# EAGLE schematic TM (EAGLE 7.5.0)
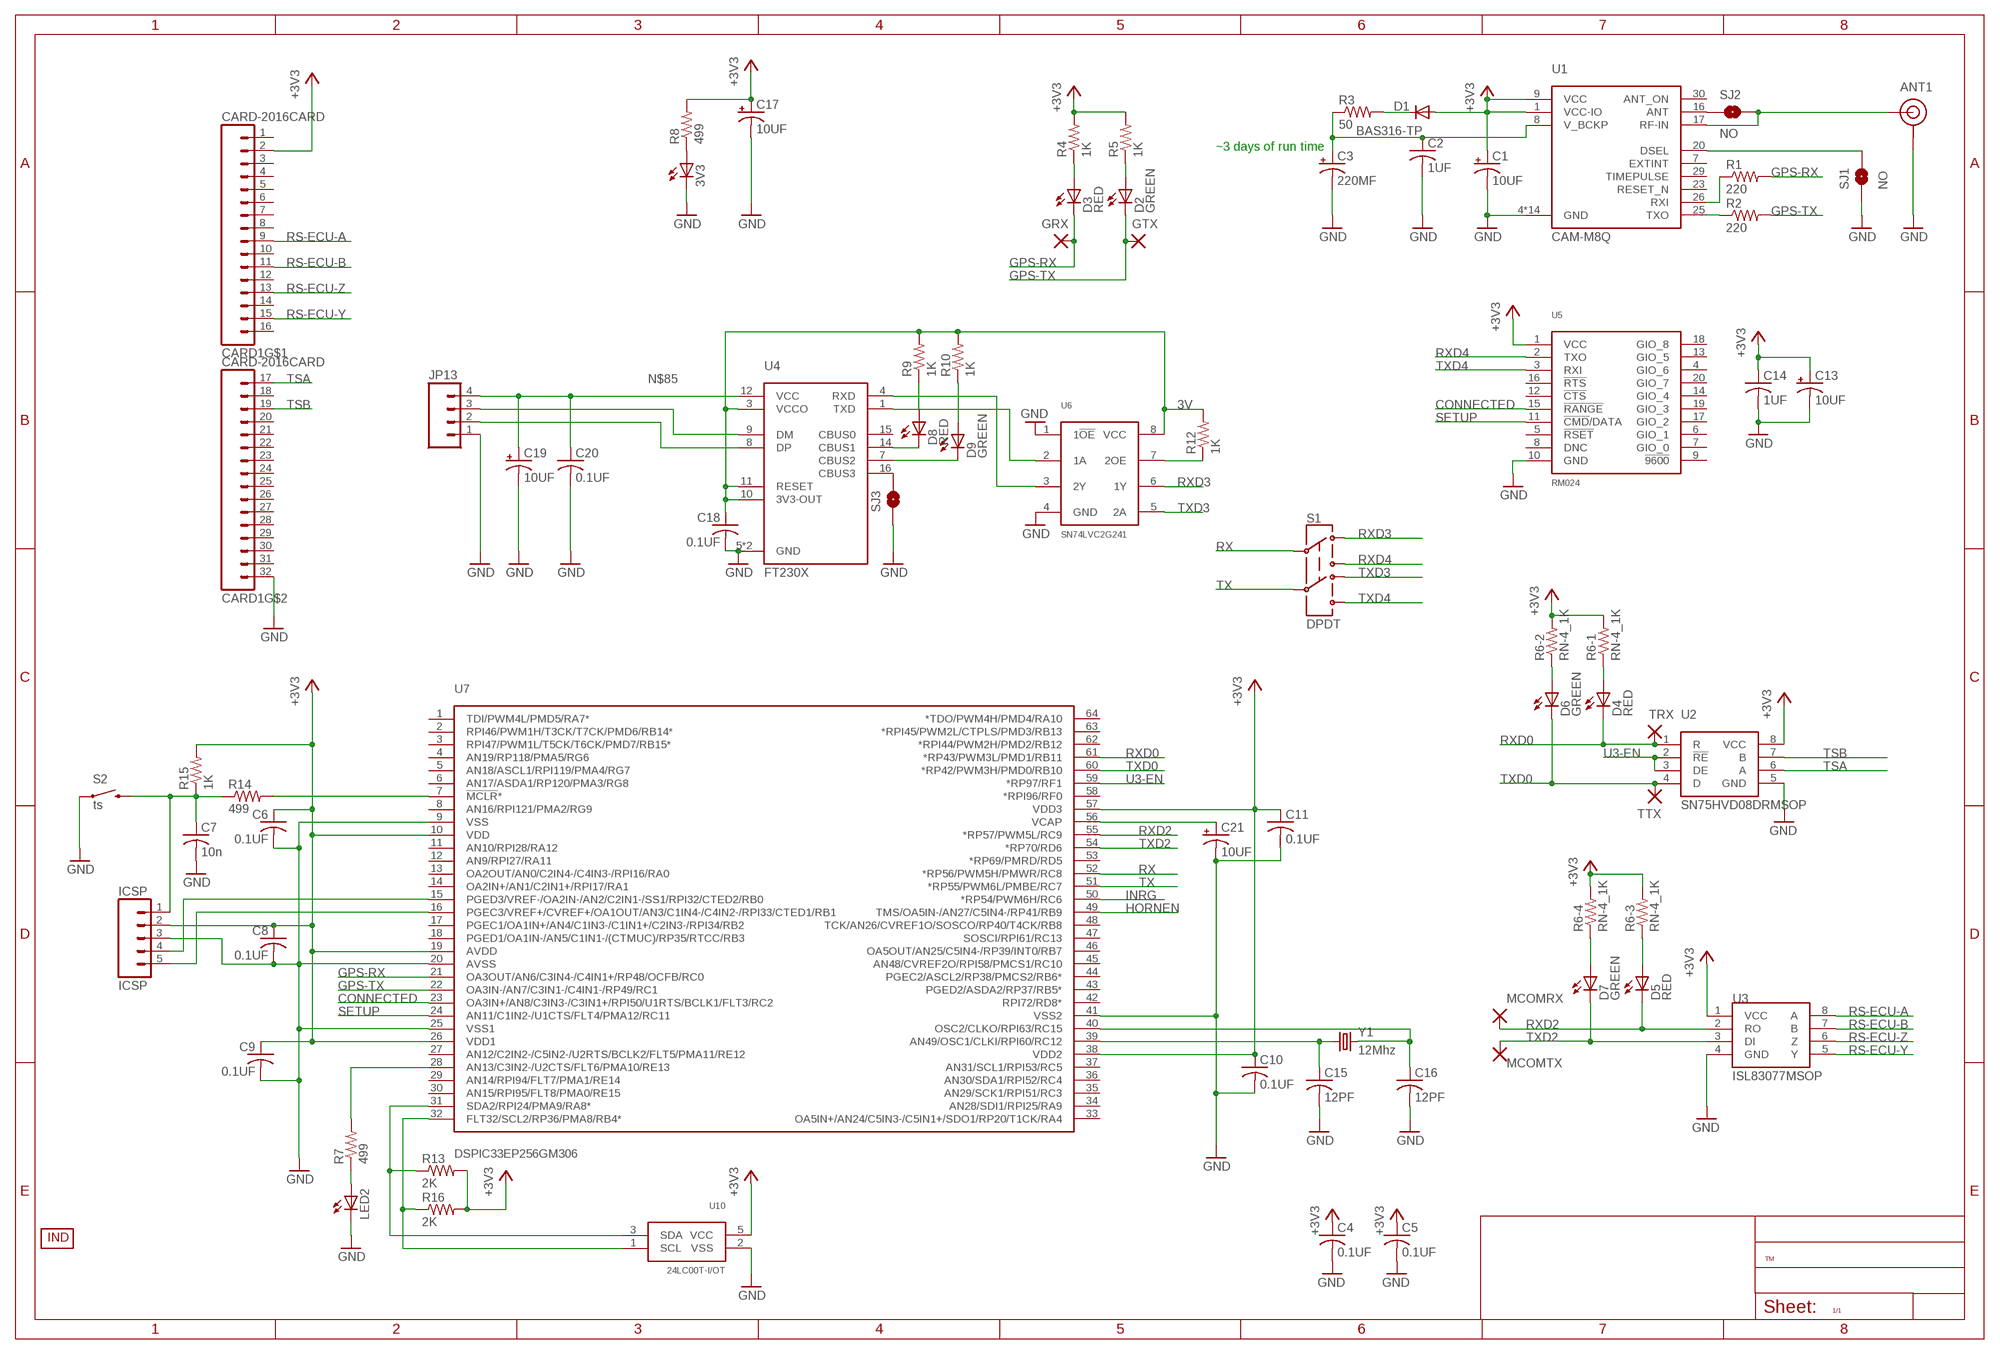
[diagram p0: schematic, sheet 1]

## Parts
3V3  LEDCHIP-LED0805  [CHIP-LED0805]
ANT1  CONMCX002  SMA  [CONSMA002]
C1  10UF  CAP-POL_10UF_16V  [EIA3216-16V]
C2  1UF  CAP_1UF_50V_0805  [0805]
C3  220MF  CAP-POL_220MF_5.5V  [EEC-S0HD224V]
C4  0.1UF  CAP_0.1UF_50V_0805  [0805]
C5  0.1UF  CAP_0.1UF_50V_0805  [0805]
C6  0.1UF  CAP_0.1UF_50V_0805  [0805]
C7  10n  C-USC0805  [C0805]
C8  0.1UF  CAP_0.1UF_50V_0805  [0805]
C9  0.1UF  CAP_0.1UF_50V_0805  [0805]
C10  0.1UF  CAP_0.1UF_50V_0805  [0805]
C11  0.1UF  CAP_0.1UF_50V_0805  [0805]
C13  10UF  CAP-POL_10UF_16V  [EIA3216-16V]
C14  1UF  CAP_1UF_50V_0805  [0805]
C15  12PF  CAP_12PF_50V_0805  [0805]
C16  12PF  CAP_12PF_50V_0805  [0805]
C17  10UF  CAP-POL_10UF_16V  [EIA3216-16V]
C18  0.1UF  CAP_0.1UF_50V_0805  [0805]
C19  10UF  CAP-POL_10UF_16V  [EIA3216-16V]
C20  0.1UF  CAP_0.1UF_50V_0805  [0805]
C21  10UF  CAP-POL_10UF_16V  [EIA3216-16V]
CARD1  CARD-2016CARD  [CARD-2016]
D1  BAS316-TP  DIODESOD  [SOD-323]
D2  GREEN  LED_GREEN  [CHIP_LED0805]
D3  RED  LED_RED  [CHIP_LED0805]
D4  RED  LED_RED  [CHIP_LED0805]
D5  RED  LED_RED  [CHIP_LED0805]
D6  GREEN  LED_GREEN  [CHIP_LED0805]
D7  GREEN  LED_GREEN  [CHIP_LED0805]
D8  RED  LED_RED  [CHIP_LED0805]
D9  GREEN  LED_GREEN  [CHIP_LED0805]
GRX  TP  [0603]
GTX  TP  [0603]
ICSP  ICSP  M05LOCK_LONGPADS  [1X05_LOCK_LONGPADS]
JP13  M04POLAR_LOCK  [MOLEX-1X4_LOCK]
LED2  LEDCHIP-LED0805  [CHIP-LED0805]
MCOMRX  TP  [0603]
MCOMTX  TP  [0603]
R1  220  RES_220_1%_0805  [0805]
R2  220  RES_220_1%_0805  [0805]
R3  50  RESISTOR2010  [R2010]
R4  1K  RES_1K_1%_0805  [0805]
R5  1K  RES_1K_1%_0805  [0805]
R6  RN-4_1K  [MNR14]
R7  499  RES_499_1%_0805  [0805]
R8  499  RES_499_1%_0805  [0805]
R9  1K  RES_1K_1%_0805  [0805]
R10  1K  RES_1K_1%_0805  [0805]
R12  1K  RES_1K_1%_0805  [0805]
R13  2K  RES_2K_1%_0805  [0805]
R14  499  RES_499_1%_0805  [0805]
R15  1K  RES_1K_1%_0805  [0805]
R16  2K  RES_2K_1%_0805  [0805]
S1  DPDT  SWITCH-DPDTAYZ0202  [AYZ0202]
S2  ts  SWITCH-MOMENTARY-2SMD-2  [TACTILE_SWITCH_SMD-2]
SJ1  NO  SOLDERJUMPERNO  [SJ_2S-NO]
SJ2  NO  SOLDERJUMPERNO  [SJ_2S-NO]
SJ3  JUMPER-PAD-2-NOYES_SILK  [PAD-JUMPER-2-NO_YES_SILK]
TRX  TP  [0603]
TTX  TP  [0603]
U1  CAM-M8Q  [CAM-M8Q]
U2  SN75HVD08DRMSOP  [MSOP-8]
U3  ISL83077MSOP  [MSOP8]
U4  FT230X  [SSOP-16]
U5  RM024  [RM024-TH]
U6  SN74LVC2G241  [VFSOP-8]
U7  DSPIC33EP256GM306  [TQFP-64]
U10  24LC00T-I/OT  [SOT23-5]
U$3  INDPK1  [PICKIT-PIN-1]
Y1  12Mhz  CRYSTAL5X3  [CRYSTAL-SMD-5X3]

## Nets
3V: C18.1(+) R9.2 R10.2 R12.2 U4.3(VCCO) U4.10(3V3-OUT) U4.11(RESET) U6.8(VCC)
+3V3: C1.A(+) C4.1(+) C5.1(+) C6.1(+) C8.1(+) C9.1(+) C10.1(+) C11.1(+) C13.A(+) C14.1(+) C17.A(+) CARD1.2 D1.2(A) ICSP.2 R4.2 R5.2 R6.5 R6.6 R6.7 R6.8 R8.2 R13.2 R15.2 R16.2 U1.1(VCC-IO) U1.9(VCC) U2.8(VCC) U3.1(VCC) U5.1(VCC) U7.10(VDD) U7.19(AVDD) U7.26(VDD1) U7.38(VDD2) U7.57(VDD3) U10.5(VCC)
CONNECTED: U5.15(!RANGE) U7.23(OA3IN+/AN8/C3IN3-/C3IN1+/RPI50/U1RTS/BCLK1/FLT3/RC2)
GND: 3V3.C ANT1.1(GND) ANT1.2(GND) ANT1.3(GND) ANT1.4(GND) C1.C(-) C2.2(-) C3.- C4.2(-) C5.2(-) C6.2(-) C7.2 C8.2(-) C9.2(-) C10.2(-) C11.2(-) C13.C(-) C14.2(-) C15.2(-) C16.2(-) C17.C(-) C18.2(-) C19.C(-) C20.2(-) C21.C(-) CARD1.32 ICSP.3 JP13.1 LED2.C S2.2 SJ1.1 SJ3.1 U1.4(GND) U1.5(GND) U1.10(GND) U1.11(GND) U1.12(GND) U1.13(GND) U1.14(GND) U1.15(GND) U1.18(GND) U1.19(GND) U1.21(GND) U1.22(GND) U1.27(GND) U1.31(GND) U2.5(GND) U3.4(GND) U4.5(GND) U4.13(GND) U5.10(GND) U6.1(1!OE) U6.4(GND) U7.9(VSS) U7.20(AVSS) U7.25(VSS1) U7.41(VSS2) U10.2(VSS)
GPS-RX: D3.C GRX.1 GRX.2 R1.2 U7.21(OA3OUT/AN6/C3IN4-/C4IN1+/RP48/OCFB/RC0)
GPS-TX: D2.C GTX.1 GTX.2 R2.2 U7.22(OA3IN-/AN7/C3IN1-/C4IN1-/RP49/RC1)
HORNEN: U7.49(TMS/OA5IN-/AN27/C5IN4-/RP41/RB9)
INRG: U7.50(*RP54/PWM6H/RC6)
N$1: D2.A R5.1
N$2: R2.1 U1.25(TXO)
N$3: ANT1.C(SIGNAL) SJ2.2 U1.17(RF-IN)
N$4: R1.1 U1.26(RXI)
N$5: SJ1.2 U1.20(DSEL)
N$6: D1.1(C) R3.2
N$7: 3V3.A R8.1
N$8: C2.1(+) C3.+ R3.1 U1.8(V_BCKP)
N$9: D7.A R6.4
N$10: D5.A R6.3
N$12: R7.2 U7.28(AN13/C3IN2-/U2CTS/FLT6/PMA10/RE13)
N$13: C16.1(+) U7.40(OSC2/CLKO/RPI63/RC15) Y1.3
N$14: C15.1(+) U7.39(AN49/OSC1/CLKI/RPI60/RC12) Y1.1
N$15: LED2.A R7.1
N$16: R13.1 U7.31(SDA2/RPI24/PMA9/RA8*) U10.3(SDA)
N$17: SJ2.1 U1.16(ANT)
N$18: D9.A R10.1
N$19: D9.C U4.7(CBUS2)
N$20: D8.C U4.14(CBUS1)
N$21: U4.4(RXD) U6.3(2Y)
N$22: D4.A R6.1
N$23: D6.A R6.2
N$24: D3.A R4.1
N$25: SJ3.2 U4.16(CBUS3)
N$27: U4.1(TXD) U6.2(1A)
N$28: JP13.3 U4.9(DM)
N$29: D8.A R9.1
N$32: R16.1 U7.32(FLT32/SCL2/RP36/PMA8/RB4*) U10.1(SCL)
N$61: JP13.2 U4.8(DP)
N$69: R12.1 U6.7(2OE)
N$85: C19.A(+) C20.1(+) JP13.4 U4.12(VCC)
N$86: C7.1 ICSP.1 R14.1 R15.1 S2.1
N$87: R14.2 U7.7(!MCLR!*)
N$88: C21.A(+) U7.56(VCAP)
N$90: ICSP.4 U7.15(PGED3/VREF-/OA2IN-/AN2/C2IN1-/SS1/RPI32/CTED2/RB0)
N$91: ICSP.5 U7.16(PGEC3/VREF+/CVREF+/OA1OUT/AN3/C1IN4-/C4IN2-/RPI33/CTED1/RB1)
RS-ECU-A: CARD1.9 U3.8(A)
RS-ECU-B: CARD1.11 U3.7(B)
RS-ECU-Y: CARD1.15 U3.5(Y)
RS-ECU-Z: CARD1.13 U3.6(Z)
RX: S1.2 U7.52(*RP56/PWM5H/PMWR/RC8)
RXD0: D4.C TRX.1 TRX.2 U2.1(R) U7.61(*RP43/PWM3L/PMD1/RB11)
RXD2: D5.C MCOMRX.1 MCOMRX.2 U3.2(RO) U7.55(*RP57/PWM5L/RC9)
RXD3: S1.1 U6.6(1Y)
RXD4: S1.3 U5.2(TXO)
SETUP: U5.11(!CMD!/DATA) U7.24(AN11/C1IN2-/U1CTS/FLT4/PMA12/RC11)
TSA: CARD1.17 U2.6(A)
TSB: CARD1.19 U2.7(B)
TX: S1.5 U7.51(*RP55/PWM6L/PMBE/RC7)
TXD0: D6.C TTX.1 TTX.2 U2.4(D) U7.60(*RP42/PWM3H/PMD0/RB10)
TXD2: D7.C MCOMTX.1 MCOMTX.2 U3.3(DI) U7.54(*RP70/RD6)
TXD3: S1.4 U6.5(2A)
TXD4: S1.6 U5.3(RXI)
U3-EN: U2.2(!RE) U2.3(DE) U7.59(*RP97/RF1)
Unconnected: CARD1.1 CARD1.3 CARD1.4 CARD1.5 CARD1.6 CARD1.7 CARD1.8 CARD1.10 CARD1.12 CARD1.14 CARD1.16 CARD1.18 CARD1.20 CARD1.21 CARD1.22 CARD1.23 CARD1.24 CARD1.25 CARD1.26 CARD1.27 CARD1.28 CARD1.29 CARD1.30 CARD1.31 U1.7(EXTINT) U1.23(RESET_N) U1.29(TIMEPULSE) U1.30(ANT_ON) U4.15(CBUS0) U5.4(GIO_6) U5.5(!RSET) U5.6(GIO_1) U5.7(GIO_0) U5.8(DNC) U5.9(!9600) U5.12(!CTS) U5.13(GIO_5) U5.14(GIO_4) U5.16(!RTS) U5.17(GIO_2) U5.18(GIO_8) U5.19(GIO_3) U5.20(GIO_7) U7.1(TDI/PWM4L/PMD5/RA7*) U7.2(RPI46/PWM1H/T3CK/T7CK/PMD6/RB14*) U7.3(RPI47/PWM1L/T5CK/T6CK/PMD7/RB15*) U7.4(AN19/RP118/PMA5/RG6) U7.5(AN18/ASCL1/RPI119/PMA4/RG7) U7.6(AN17/ASDA1/RP120/PMA3/RG8) U7.8(AN16/RPI121/PMA2/RG9) U7.11(AN10/RPI28/RA12) U7.12(AN9/RPI27/RA11) U7.13(OA2OUT/AN0/C2IN4-/C4IN3-/RPI16/RA0) U7.14(OA2IN+/AN1/C2IN1+/RPI17/RA1) U7.17(PGEC1/OA1IN+/AN4/C1IN3-/C1IN1+/C2IN3-/RPI34/RB2) U7.18(PGED1/OA1IN-/AN5/C1IN1-/(CTMUC)/RP35/RTCC/RB3) U7.27(AN12/C2IN2-/C5IN2-/U2RTS/BCLK2/FLT5/PMA11/RE12) U7.29(AN14/RPI94/FLT7/PMA1/RE14) U7.30(AN15/RPI95/FLT8/PMA0/RE15) U7.33(OA5IN+/AN24/C5IN3-/C5IN1+/SDO1/RP20/T1CK/RA4) U7.34(AN28/SDI1/RPI25/RA9) U7.35(AN29/SCK1/RPI51/RC3) U7.36(AN30/SDA1/RPI52/RC4) U7.37(AN31/SCL1/RPI53/RC5) U7.42(RPI72/RD8*) U7.43(PGED2/ASDA2/RP37/RB5*) U7.44(PGEC2/ASCL2/RP38/PMCS2/RB6*) U7.45(AN48/CVREF2O/RPI58/PMCS1/RC10) U7.46(OA5OUT/AN25/C5IN4-/RP39/INT0/RB7) U7.47(SOSCI/RPI61/RC13) U7.48(TCK/AN26/CVREF1O/SOSCO/RP40/T4CK/RB8) U7.53(*RP69/PMRD/RD5) U7.58(*RPI96/RF0) U7.62(*RPI44/PWM2H/PMD2/RB12) U7.63(*RPI45/PWM2L/CTPLS/PMD3/RB13) U7.64(*TDO/PWM4H/PMD4/RA10)

## Notes on the sheet
- ~3 days of run time

## Library data of the parts
3V3 LED2 = adafruit:LED: LED OSRAM: - CHIPLED LG R971, LG N971, LY N971, LG Q971, LY Q971, LO R971, LY R971 LH N974, LH R974 LS Q976, LO Q976, LY Q976 LO Q996 - Hyper CHIPLED LW Q18S LB Q993, LB Q99A, LB R99A - SideLED LS A670, LO A670, LY A670, LG A670, LP A670 LB A673, LV A673, LT A673, LW A673 LH A674 LY A675 LS A676, LA A676, LO A676, LY A676, LW A676 LS A679, LY A679, LG A679 - Hyper Micro SIDELED® LS Y876, LA Y876, LO Y876, LY Y876 LT Y87S - SmartLED LW L88C, LW L88S LB L89C, LB L89S, LG L890 LS L89K, LO L89K, LY L89K LS L896, LA L896, LO L896, LY L896 - TOPLED LS T670, LO T670, LY T670, LG T670, LP T670 LSG T670, LSP T670, LSY T670, LOP T670, LYG T670 LG T671, LOG T671, LSG T671 LB T673, LV T673, LT T673, LW T673 LH T674 LS T676, LA T676, LO T676, LY T676, LB T676, LH T676, LSB T676, LW T676 LB T67C, LV T67C, LT T67C, LS T67K, LO T67K, LY T67K, LW E67C LS E67B, LA E67B, LO E67B, LY E67B, LB E67C, LV E67C, LT E67C LW T67C LS T679, LY T679, LG T679 LS T770, LO T770, LY T770, LG T770, LP T770 LB T773, LV T773, LT T773, LW T773 LH T774 LS E675, LA E675, LY E675, LS T675 LS T776, LA T776, LO T776, LY T776, LB T776 LHGB T686 LT T68C, LB T68C - Hyper Mini TOPLED® LB M676 - Mini TOPLED Santana® LG M470 LS M47K, LO M47K, LY M47K Source: http://www.osram.convergy.de/
ANT1 = FSAE Eletric:SMA
C1 C13 C17 C19 C21 = FSAE Electric:CAP-POL; PARTNO: T491A106M016AT
C2 C14 = FSAE Electric:CAP; PARTNO: UMK212F105ZG-T
C3 = FSAE Electric:CAP-POL; PARTNO: EEC-S0HD224V
C4-C6 C8-C11 C18 C20 = FSAE Electric:CAP; PARTNO: CC0805ZRY5V9BB104
C7 = adafruit:C-US: CAPACITOR, American symbol
C15 C16 = FSAE Electric:CAP; PARTNO: CL21C120JBANNNC
CARD1 = FSAE Electric:CARD-2016
D1 = SparkFun-DiscreteSemi:DIODE: Diode These are standard reverse protection diodes and small signal diodes. SMA package can handle up to about 1A. SOD-323 can handle about 200mA. What the SOD-323 package when ordering, there are some mfgs out there that are 5-pin packages.
D2 D6 D7 D9 = FSAE Electric:LED; PARTNO: LTST-S220GKT
D3-D5 D8 = FSAE Electric:LED; PARTNO: LH R974-LP-1
GRX GTX MCOMRX MCOMTX TRX TTX = FSAE Electric:TP: SMD test points to make life easy to test / debug; PARTNO: 1625854-3
ICSP = SparkFun-Connectors:M05: Header 5 Standard 5-pin 0.1" header. Use with straight break away headers (SKU : PRT-00116), right angle break away headers (PRT-00553), swiss pins (PRT-00743), machine pins (PRT-00117), and female headers (PRT-00115). Molex polarized connector foot print use with SKU : PRT-08230 with associated crimp pins and housings.
JP13 = SparkFun-Connectors:M04: Header 4 Standard 4-pin 0.1" header. Use with straight break away headers (SKU : PRT-00116), right angle break away headers (PRT-00553), swiss pins (PRT-00743), machine pins (PRT-00117), and female headers (PRT-00115). Molex polarized connector foot print use with SKU : PRT-08231 with associated crimp pins and housings. 1MM SMD Version SKU: PRT-10208
R1 R2 = FSAE Electric:RES: Resistors; PARTNO: RC0805FR-07220RL
R3 = SparkFun-Passives:RESISTOR: Resistor Basic schematic elements and footprints for 0603, 1206, and PTH resistors.
R4 R5 R9 R10 R12 R15 = FSAE Electric:RES: Resistors; PARTNO: RC0805FR-071KL
R6 = FSAE Electric:RN-4; PARTNO: MNR14ERAPJ102
R7 R8 R14 = FSAE Electric:RES: Resistors; PARTNO: RC0805FR-07499RL
R13 R16 = FSAE Electric:RES: Resistors; PARTNO: RC0805FR-072KL
S1 = SparkFun-Electromechanical:SWITCH-DPDT: DPDT Version of the COM-00597; PROD_ID: SWCH-08179
S2 = SparkFun-Electromechanical:SWITCH-MOMENTARY-2: Various NO switches- pushbuttons, reed, etc
SJ1 SJ2 = SparkFun-Passives:SOLDERJUMPER: Solder Jumper Standard SMD solder jumper. Used to automate production. Two varients : Normally Open and Normally Closed are the same, but have different paste layers. NC will have a large amount of paste and should jumper during reflow.
SJ3 = SparkFun-Passives:JUMPER-PAD-2-NO
U1 = FSAE Eletric:CAM-M8Q
U2 = FSAE Electric:SN75HVD08DR: RS485 Transceiver View on DigiKey <http://www.digikey.com/product-detail/en/SN75HVD08DR/296-37893-1-ND/4899996>; PARTNO: ISL83072EIUZA-T
U3 = NASA_LIB:ISL83077; PARTNO: ISL83072EIUZA-T
U4 = FSAE Electric:FT230X: FTDI USB to Serial IC; PARTNO: FT230XS-R
U5 = FSAE Eletric:RM024
U6 = FSAE Electric:SN74LVC2G241; PARTNO: SN74LVC2G241DCUR
U7 = FSAE Eletric:DSPIC33EP256GM306
U10 = FSAE Electric:24LC00T-I/OT; PARTNO: 24LC00T-I/OT
U$3 = FSAE Eletric:IND
Y1 = SparkFun-FreqCtrl:CRYSTAL: Various standard crystals. Proven footprints. Spark Fun Electronics SKU : COM-00534